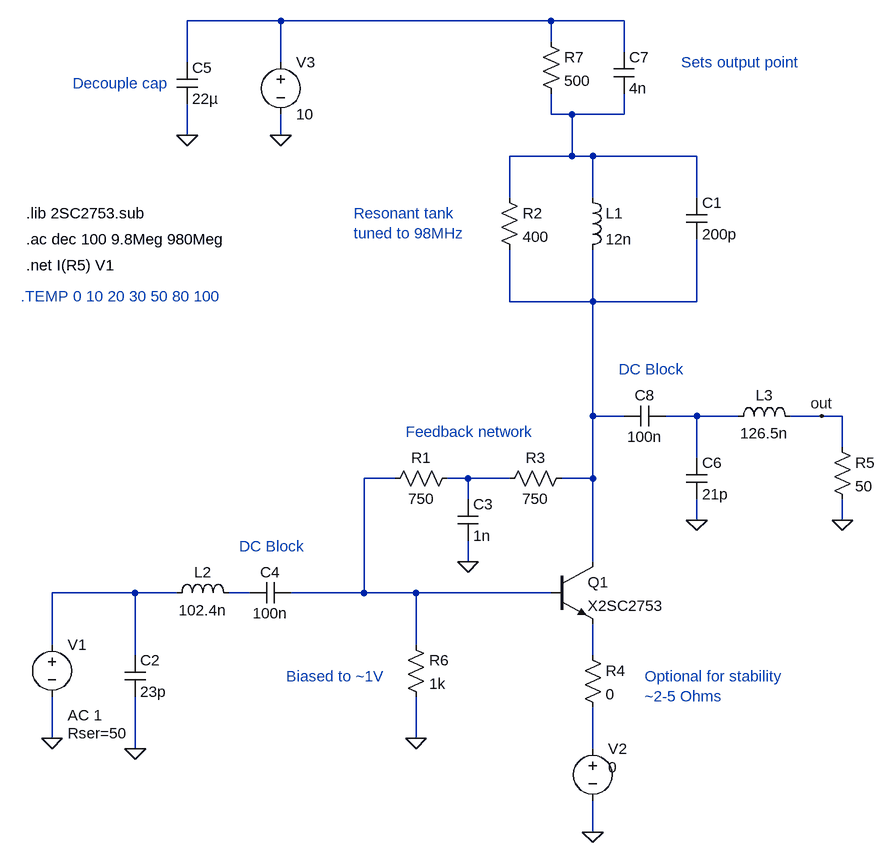
[diagram p0: schematic narrowband.asc]
narrowband.asc, the LTspice schematic file:
Version 4
SHEET 1 1396 692
WIRE -224 -608 -368 -608
WIRE 192 -608 -224 -608
WIRE 304 -608 192 -608
WIRE 192 -576 192 -608
WIRE 304 -560 304 -608
WIRE -368 -544 -368 -608
WIRE -224 -544 -224 -608
WIRE 192 -464 192 -496
WIRE 224 -464 192 -464
WIRE 304 -464 304 -496
WIRE 304 -464 224 -464
WIRE -368 -432 -368 -480
WIRE -224 -432 -224 -464
WIRE 224 -400 224 -464
WIRE 224 -400 128 -400
WIRE 256 -400 224 -400
WIRE 416 -400 256 -400
WIRE 128 -336 128 -400
WIRE 256 -336 256 -400
WIRE 416 -336 416 -400
WIRE 128 -176 128 -256
WIRE 256 -176 256 -256
WIRE 256 -176 128 -176
WIRE 416 -176 416 -272
WIRE 416 -176 256 -176
WIRE 256 0 256 -176
WIRE 304 0 256 0
WIRE 416 0 368 0
WIRE 480 0 416 0
WIRE 608 0 560 0
WIRE 640 0 608 0
WIRE 640 48 640 0
WIRE 416 64 416 0
WIRE -48 96 -96 96
WIRE 64 96 32 96
WIRE 128 96 64 96
WIRE 256 96 256 0
WIRE 256 96 208 96
WIRE 64 128 64 96
WIRE 416 160 416 128
WIRE 640 160 640 128
WIRE 64 224 64 192
WIRE 256 224 256 96
WIRE -448 272 -576 272
WIRE -384 272 -448 272
WIRE -272 272 -304 272
WIRE -96 272 -96 96
WIRE -96 272 -208 272
WIRE -16 272 -96 272
WIRE 192 272 -16 272
WIRE -576 352 -576 272
WIRE -16 352 -16 272
WIRE -448 368 -448 272
WIRE 256 368 256 320
WIRE -576 496 -576 432
WIRE -16 496 -16 432
WIRE -448 512 -448 432
WIRE 256 512 256 448
WIRE 256 640 256 592
FLAG 256 640 0
FLAG -224 -432 0
FLAG -16 496 0
FLAG 608 0 out
FLAG 64 224 0
FLAG -576 496 0
FLAG -368 -432 0
FLAG 640 160 0
FLAG -448 512 0
FLAG 416 160 0
SYMBOL ind 240 -352 R0
SYMATTR InstName L1
SYMATTR Value 12n
SYMBOL cap 400 -336 R0
SYMATTR InstName C1
SYMATTR Value 200p
SYMBOL npn 192 224 R0
SYMATTR InstName Q1
SYMATTR Value X2SC2753
SYMATTR Prefix X1
SYMBOL voltage -224 -560 R0
WINDOW 123 0 0 Left 0
WINDOW 39 0 0 Left 0
SYMATTR InstName V3
SYMATTR Value 10
SYMBOL res -32 336 R0
SYMATTR InstName R6
SYMATTR Value 1k
SYMBOL res 112 -352 R0
SYMATTR InstName R2
SYMATTR Value 400
SYMBOL res 224 80 R90
WINDOW 0 0 56 VBottom 2
WINDOW 3 32 56 VTop 2
SYMATTR InstName R3
SYMATTR Value 750
SYMBOL res 176 -592 R0
SYMATTR InstName R7
SYMATTR Value 500
SYMBOL res 48 80 R90
WINDOW 0 0 56 VBottom 2
WINDOW 3 32 56 VTop 2
SYMATTR InstName R1
SYMATTR Value 750
SYMBOL cap 48 128 R0
SYMATTR InstName C3
SYMATTR Value 1n
SYMBOL cap 288 -560 R0
SYMATTR InstName C7
SYMATTR Value 4n
SYMBOL cap 368 -16 R90
WINDOW 0 0 32 VBottom 2
WINDOW 3 32 32 VTop 2
SYMATTR InstName C8
SYMATTR Value 100n
SYMBOL cap -208 256 R90
WINDOW 0 0 32 VBottom 2
WINDOW 3 32 32 VTop 2
SYMATTR InstName C4
SYMATTR Value 100n
SYMBOL res 240 352 R0
SYMATTR InstName R4
SYMATTR Value 0
SYMBOL cap -384 -544 R0
SYMATTR InstName C5
SYMATTR Value 22µ
SYMBOL voltage 256 496 R0
WINDOW 3 24 44 Left 2
WINDOW 123 0 0 Left 0
WINDOW 39 0 0 Left 0
SYMATTR Value 0
SYMATTR InstName V2
SYMBOL res 624 32 R0
SYMATTR InstName R5
SYMATTR Value 50
SYMBOL voltage -576 336 R0
WINDOW 123 24 124 Left 2
WINDOW 39 24 152 Left 2
SYMATTR InstName V1
SYMATTR Value ""
SYMATTR Value2 AC 1
SYMATTR SpiceLine Rser=50
SYMBOL cap -464 368 R0
SYMATTR InstName C2
SYMATTR Value 23p
SYMBOL ind -400 288 R270
WINDOW 0 32 56 VTop 2
WINDOW 3 5 56 VBottom 2
SYMATTR InstName L2
SYMATTR Value 102.4n
SYMBOL cap 400 64 R0
SYMATTR InstName C6
SYMATTR Value 21p
SYMBOL ind 464 16 R270
WINDOW 0 32 56 VTop 2
WINDOW 3 5 56 VBottom 2
SYMATTR InstName L3
SYMATTR Value 126.5n
TEXT -616 -312 Left 2 !.lib 2SC2753.sub
TEXT -616 -272 Left 2 !.ac dec 100 9.8Meg 980Meg
TEXT -616 -232 Left 2 !.net I(R5) V1
TEXT -624 -184 Left 2 ;.TEMP 0 10 20 30 50 80 100
TEXT -288 200 Left 2 ;DC Block
TEXT -216 400 Left 2 ;Biased to ~1V
TEXT -112 -312 Left 2 ;Resonant tank\ntuned to 98MHz
TEXT 392 -544 Left 2 ;Sets output point
TEXT -32 24 Left 2 ;Feedback network
TEXT 336 400 Left 2 ;Optional for stability\n~2-5 Ohms
TEXT 296 -72 Left 2 ;DC Block
TEXT -544 -512 Left 2 ;Decouple cap

The netlist it stands for:
* narrowband.asc
L1 N002 N003 12n
C1 N002 N003 200p
XQ1 N003 N005 N009 X2SC2753  ; pins C B E
V3 N001 0 10
R6 N005 0 1k
R2 N002 N003 400
R3 N003 N006 750
R7 N001 N002 500
R1 N006 N005 750
C3 N006 0 1n
C7 N001 N002 4n
C8 N004 N003 100n
C4 N005 N008 100n
R4 N009 N010 0
C5 N001 0 22µ
V2 N010 0 0
R5 out 0 50
V1 N007 0 AC 1 Rser=50
C2 N007 0 23p
L2 N007 N008 102.4n
C6 N004 0 21p
L3 N004 out 126.5n
.lib 2SC2753.sub
.ac dec 100 9.8Meg 980Meg
.net I(R5) V1
* .TEMP 0 10 20 30 50 80 100
* DC Block
* Biased to ~1V
* Resonant tank
* tuned to 98MHz
* Sets output point
* Feedback network
* Optional for stability
* ~2-5 Ohms
* DC Block
* Decouple cap
.backanno
.end